# Altium schematic sheet STB_ControlBoard.SchDoc: STB Control Board
size A3; Author: mayerph; DrawnBy: mayerph; Organization: PBL; Revision: B; SheetNumber: 1; SheetTotal: 6
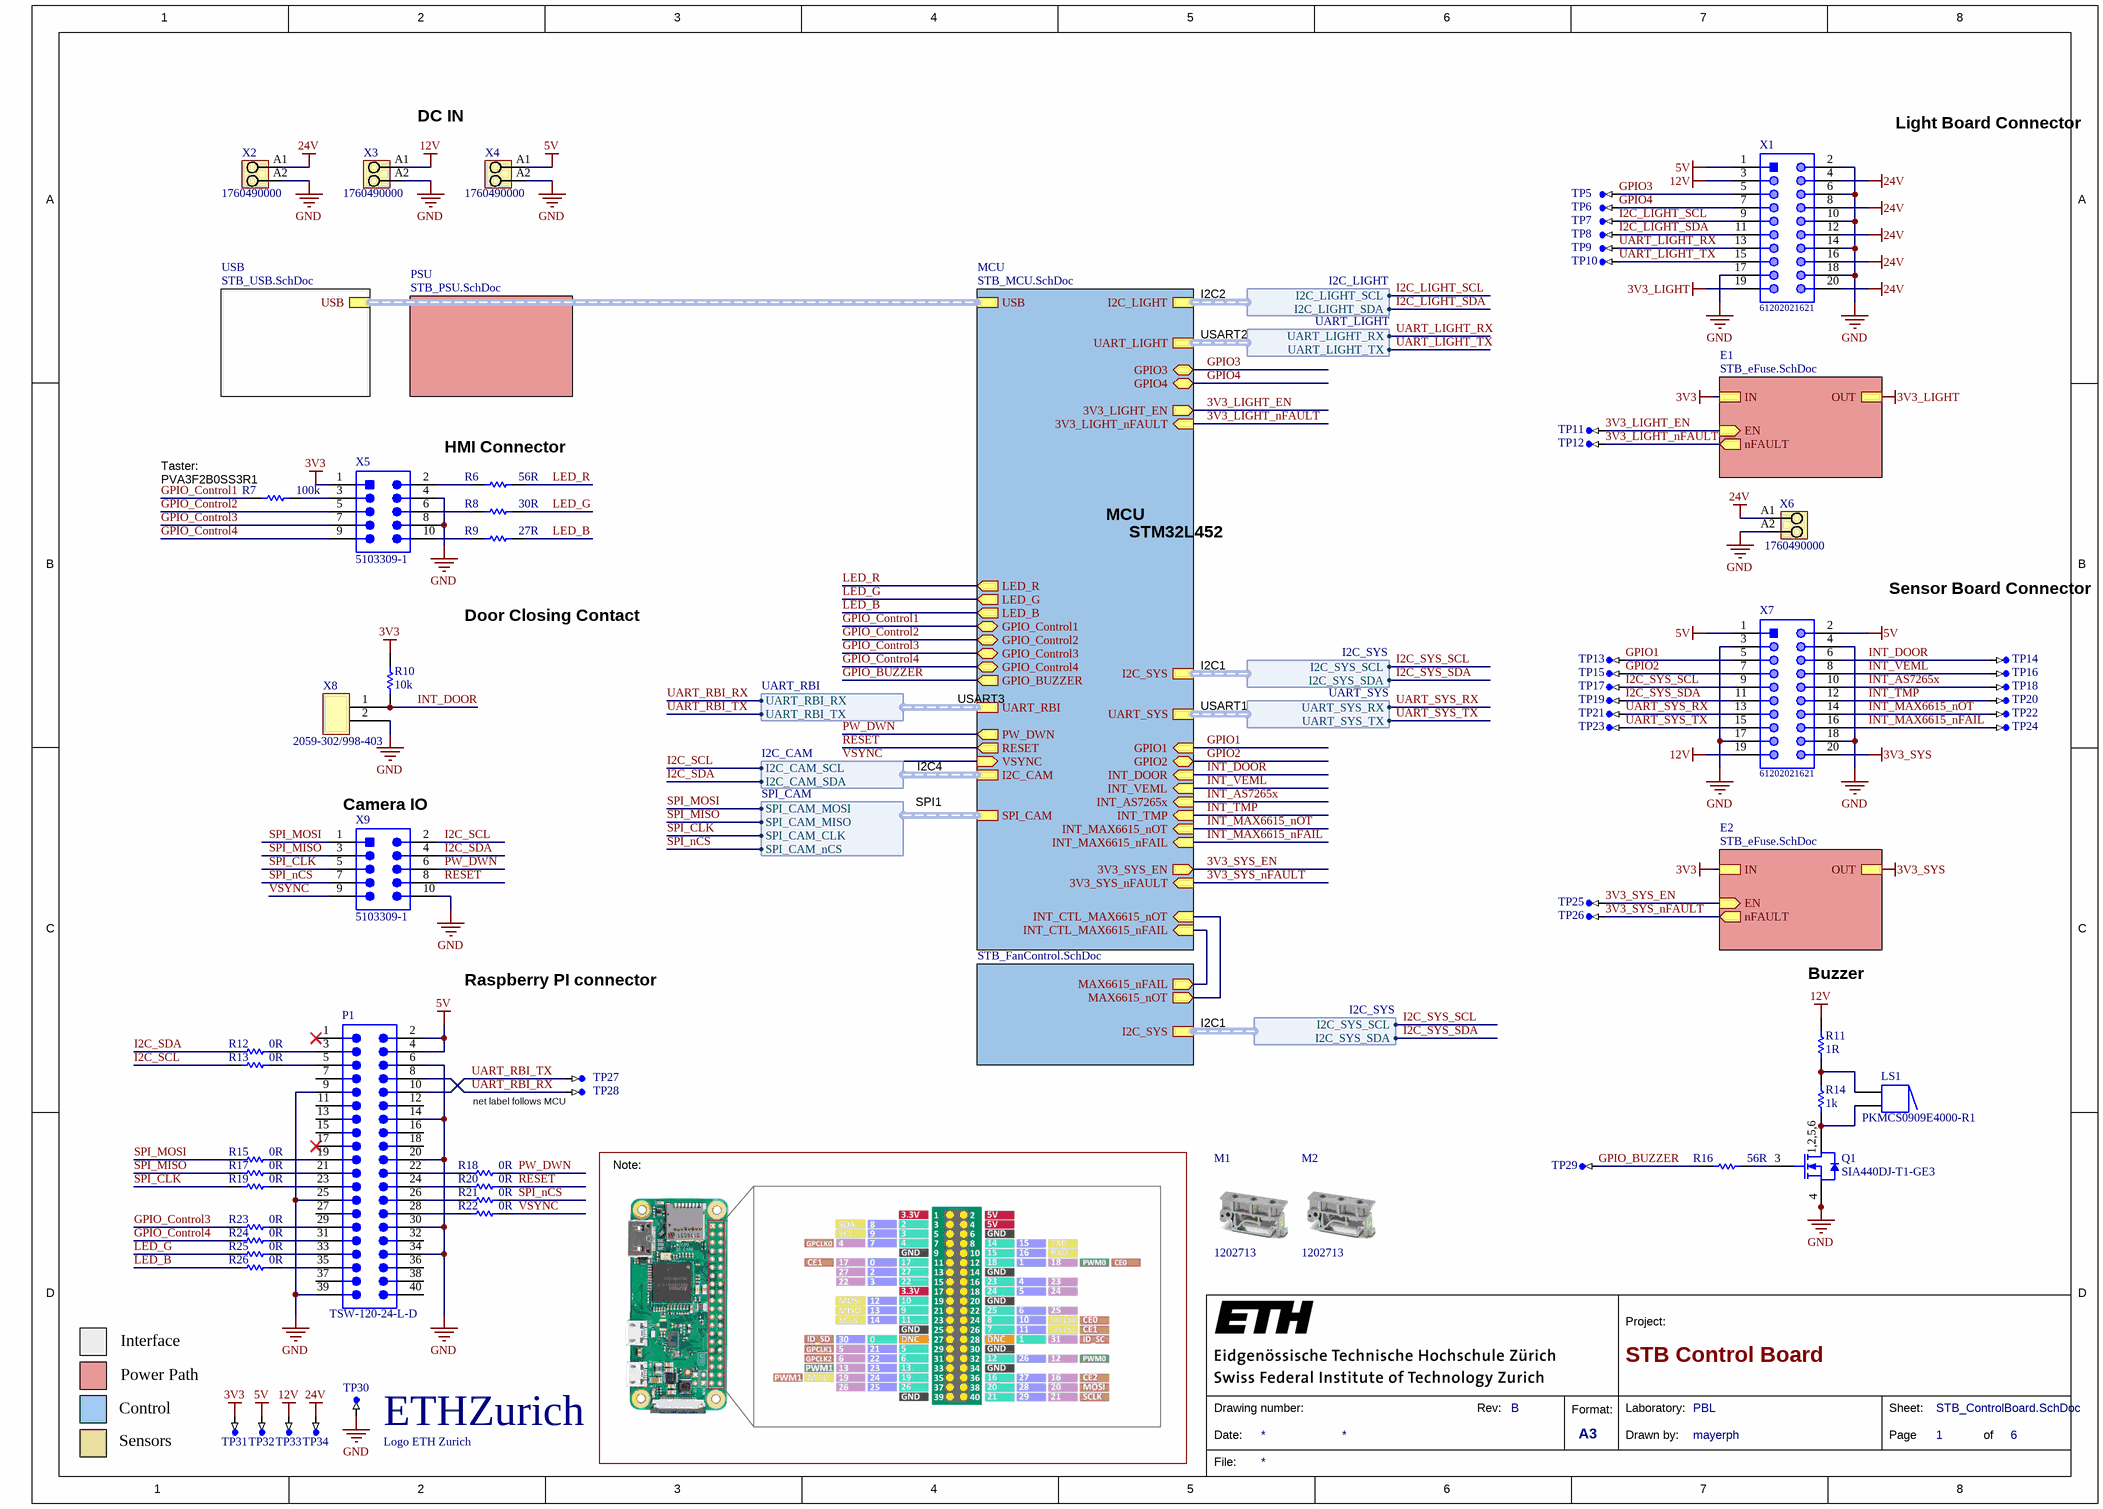
[diagram p0: STB_ControlBoard.SchDoc]

## Parts
A1  Logo ETH Zurich  [eth-zurich_3mm]  (no BOM)
LS1  PKMCS0909E4000-R1  [MURA- PKMCS0909E4000-2_V]
M1  1202713  [1202713]
M2  1202713  [1202713]
P1  TSW-120-24-L-D  [SMTC-TSW-120-24-X-D]
Q1  SIA440DJ-T1-GE3  [SC70-6L_65P210X80_HS-7L]
R6  56R  [RESC1609X50X30LL10T20]
R7  100k  [RESC1005X40X25LL05T10]
R8  30R  [RESC1609X50X30LL10T20]
R9  27R  [RESC1608X55X30LL15T15]
R10  10k  [RESC1005X40X25LL05T05]
R11  1R  [RESC3225X70X50NL20T20]
R12  0R  [RESC1005X40X25LL05T10]
R13  0R  [RESC1005X40X25LL05T10]
R14  1k  [RESC3216X70X50LL05T20]
R15  0R  [RESC1005X40X25LL05T10]
R16  56R  [RESC1609X50X30LL10T20]
R17  0R  [RESC1005X40X25LL05T10]
R18  0R  [RESC1005X40X25LL05T10]
R19  0R  [RESC1005X40X25LL05T10]
R20  0R  [RESC1005X40X25LL05T10]
R21  0R  [RESC1005X40X25LL05T10]
R22  0R  [RESC1005X40X25LL05T10]
R23  0R  [RESC1005X40X25LL05T10]
R24  0R  [RESC1005X40X25LL05T10]
R25  0R  [RESC1005X40X25LL05T10]
R26  0R  [RESC1005X40X25LL05T10]
TP5  TP_1mm  [TP-SM-C-100]  (value not drawn)  (no BOM)
TP6  TP_1mm  [TP-SM-C-100]  (value not drawn)  (no BOM)
TP7  TP_1mm  [TP-SM-C-100]  (value not drawn)  (no BOM)
TP8  TP_1mm  [TP-SM-C-100]  (value not drawn)  (no BOM)
TP9  TP_1mm  [TP-SM-C-100]  (value not drawn)  (no BOM)
TP10  TP_1mm  [TP-SM-C-100]  (value not drawn)  (no BOM)
TP11  TP_1mm  [TP-SM-C-100]  (value not drawn)  (no BOM)
TP12  TP_1mm  [TP-SM-C-100]  (value not drawn)  (no BOM)
TP13  TP_1mm  [TP-SM-C-100]  (value not drawn)  (no BOM)
TP14  TP_1mm  [TP-SM-C-100]  (value not drawn)  (no BOM)
TP15  TP_1mm  [TP-SM-C-100]  (value not drawn)  (no BOM)
TP16  TP_1mm  [TP-SM-C-100]  (value not drawn)  (no BOM)
TP17  TP_1mm  [TP-SM-C-100]  (value not drawn)  (no BOM)
TP18  TP_1mm  [TP-SM-C-100]  (value not drawn)  (no BOM)
TP19  TP_1mm  [TP-SM-C-100]  (value not drawn)  (no BOM)
TP20  TP_1mm  [TP-SM-C-100]  (value not drawn)  (no BOM)
TP21  TP_1mm  [TP-SM-C-100]  (value not drawn)  (no BOM)
TP22  TP_1mm  [TP-SM-C-100]  (value not drawn)  (no BOM)
TP23  TP_1mm  [TP-SM-C-100]  (value not drawn)  (no BOM)
TP24  TP_1mm  [TP-SM-C-100]  (value not drawn)  (no BOM)
TP25  TP_1mm  [TP-SM-C-100]  (value not drawn)  (no BOM)
TP26  TP_1mm  [TP-SM-C-100]  (value not drawn)  (no BOM)
TP27  TP_1mm  [TP-SM-C-100]  (value not drawn)  (no BOM)
TP28  TP_1mm  [TP-SM-C-100]  (value not drawn)  (no BOM)
TP29  TP_1mm  [TP-SM-C-100]  (value not drawn)  (no BOM)
TP30  TP_1mm  [TP-SM-C-100]  (value not drawn)  (no BOM)
TP31  TP_1mm  [TP-SM-C-100]  (value not drawn)  (no BOM)
TP32  TP_1mm  [TP-SM-C-100]  (value not drawn)  (no BOM)
TP33  TP_1mm  [TP-SM-C-100]  (value not drawn)  (no BOM)
TP34  TP_1mm  [TP-SM-C-100]  (value not drawn)  (no BOM)
X1  61202021621  [61202021621]
X2  1760490000  [PM_5_08_90_02]
X3  1760490000  [PM_5_08_90_02]
X4  1760490000  [PM_5_08_90_02]
X5  5103309-1  [TECO-5103309-1_V]
X6  1760490000  [PM_5_08_90_02]
X7  61202021621  [61202021621]
X8  2059-302/998-403  [2059-302/998-403]
X9  5103309-1  [TECO-5103309-1_V]

## Sub-sheets
E1 = STB_eFuse.SchDoc: IN, OUT, EN (in), nFAULT (out)
E2 = STB_eFuse.SchDoc: IN, OUT, EN (in), nFAULT (out)
FC = STB_FanControl.SchDoc: I2C_SYS (harness I2C_SYS), MAX6615_nOT (out), MAX6615_nFAIL (out)
MCU = STB_MCU.SchDoc: USB (harness USB), I2C_SYS (harness I2C_SYS), GPIO1 (in), I2C_LIGHT (harness I2C_LIGHT), UART_RBI (harness UART_RBI), UART_SYS (harness UART_SYS), UART_LIGHT (harness UART_LIGHT), INT_VEML (in), INT_AS7265x (in), INT_TMP (in), INT_MAX6615_nOT (in), INT_MAX6615_nFAIL (in), GPIO2 (bidir), INT_DOOR (in), GPIO3 (bidir), GPIO4 (bidir), 3V3_LIGHT_EN (out), 3V3_LIGHT_nFAULT (in), 3V3_SYS_EN (out), 3V3_SYS_nFAULT (in), LED_R (out), LED_G (out), LED_B (out), GPIO_Control1 (bidir), GPIO_Control2 (bidir), GPIO_Control3 (bidir), GPIO_Control4 (bidir), GPIO_BUZZER (out), PW_DWN (out), RESET (out), VSYNC (in), I2C_CAM (harness I2C_CAM), SPI_CAM (harness SPI_CAM), INT_CTL_MAX6615_nOT (in), INT_CTL_MAX6615_nFAIL (in)
PSU = STB_PSU.SchDoc: no entries
USB = STB_USB.SchDoc: USB (harness USB_HUB)

## Harnesses
I2C_SYS: I2C_SYS_SDA, I2C_SYS_SCL
I2C_LIGHT: I2C_LIGHT_SDA, I2C_LIGHT_SCL
UART_RBI: UART_RBI_TX, UART_RBI_RX
UART_SYS: UART_SYS_TX, UART_SYS_RX
UART_LIGHT: UART_LIGHT_TX, UART_LIGHT_RX
I2C_CAM: I2C_CAM_SDA, I2C_CAM_SCL
SPI_CAM: SPI_CAM_MISO, SPI_CAM_MOSI, SPI_CAM_CLK, SPI_CAM_nCS

## Nets
3V3: R10.2 TP31.TP X5.1 ; sheet E1/IN, sheet E2/IN
3V3_LIGHT: X1.19 ; sheet E1/OUT
3V3_SYS: X7.20 ; sheet E2/OUT
5V: P1.2 P1.4 TP32.TP X1.1 X4.A1 X7.1 X7.2
12V: R11.2 TP33.TP X1.3 X3.A1 X7.19
24V: TP34.TP X1.4 X1.8 X1.12 X1.16 X1.20 X2.A1 X6.A1
GND: P1.6 P1.9 P1.14 P1.20 P1.25 P1.30 P1.34 P1.39 Q1.4(SOURCE) Q1.S(SOURCE) TP30.TP X1.2 X1.6 X1.10 X1.14 X1.17 X1.18 X2.A2 X3.A2 X4.A2 X5.4 X5.8 X6.A2 X7.3 X7.4 X7.17 X7.18 X8.2 X9.10
3V3_LIGHT_EN: TP11.TP ; sheet MCU/3V3_LIGHT_EN, sheet E1/EN
3V3_LIGHT_nFAULT: TP12.TP ; sheet MCU/3V3_LIGHT_nFAULT, sheet E1/nFAULT
3V3_SYS_EN: TP25.TP ; sheet MCU/3V3_SYS_EN, sheet E2/EN
3V3_SYS_nFAULT: TP26.TP ; sheet MCU/3V3_SYS_nFAULT, sheet E2/nFAULT
GPIO1: TP13.TP X7.5 ; sheet MCU/GPIO1
GPIO2: TP15.TP X7.7 ; sheet MCU/GPIO2
GPIO3: TP5.TP X1.5 ; sheet MCU/GPIO3
GPIO4: TP6.TP X1.7 ; sheet MCU/GPIO4
GPIO_BUZZER: R16.2 TP29.TP ; sheet MCU/GPIO_BUZZER
GPIO_Control1: R7.2 ; sheet MCU/GPIO_Control1
GPIO_Control2: X5.5 ; sheet MCU/GPIO_Control2
GPIO_Control3: R23.1 X5.7 ; sheet MCU/GPIO_Control3
GPIO_Control4: R24.1 X5.9 ; sheet MCU/GPIO_Control4
I2C_LIGHT_SCL: TP7.TP X1.9 ; sheet MCU/I2C_LIGHT.I2C_LIGHT_SCL
I2C_LIGHT_SDA: TP8.TP X1.11 ; sheet MCU/I2C_LIGHT.I2C_LIGHT_SDA
I2C_SCL: R13.1 X9.2 ; sheet MCU/I2C_CAM.I2C_CAM_SCL
I2C_SDA: R12.1 X9.4 ; sheet MCU/I2C_CAM.I2C_CAM_SDA
I2C_SYS_SCL: TP17.TP X7.9 ; sheet MCU/I2C_SYS.I2C_SYS_SCL, sheet FC/I2C_SYS.I2C_SYS_SCL
I2C_SYS_SDA: TP19.TP X7.11 ; sheet MCU/I2C_SYS.I2C_SYS_SDA, sheet FC/I2C_SYS.I2C_SYS_SDA
INT_AS7265x: TP18.TP X7.10 ; sheet MCU/INT_AS7265x
INT_DOOR: R10.1 TP14.TP X7.6 X8.1 ; sheet MCU/INT_DOOR
INT_MAX6615_nFAIL: TP24.TP X7.16 ; sheet MCU/INT_MAX6615_nFAIL
INT_MAX6615_nOT: TP22.TP X7.14 ; sheet MCU/INT_MAX6615_nOT
INT_TMP: TP20.TP X7.12 ; sheet MCU/INT_TMP
INT_VEML: TP16.TP X7.8 ; sheet MCU/INT_VEML
LED_B: R9.1 R26.1 ; sheet MCU/LED_B
LED_G: R8.1 R25.1 ; sheet MCU/LED_G
LED_R: R6.1 ; sheet MCU/LED_R
PW_DWN: R18.2 X9.6 ; sheet MCU/PW_DWN
RESET: R20.2 X9.8 ; sheet MCU/RESET
SPI_CLK: R19.1 X9.5 ; sheet MCU/SPI_CAM.SPI_CAM_CLK
SPI_MISO: R17.1 X9.3 ; sheet MCU/SPI_CAM.SPI_CAM_MISO
SPI_MOSI: R15.1 X9.1 ; sheet MCU/SPI_CAM.SPI_CAM_MOSI
SPI_nCS: R21.2 X9.7 ; sheet MCU/SPI_CAM.SPI_CAM_nCS
UART_LIGHT_RX: TP9.TP X1.13 ; sheet MCU/UART_LIGHT.UART_LIGHT_RX
UART_LIGHT_TX: TP10.TP X1.15 ; sheet MCU/UART_LIGHT.UART_LIGHT_TX
UART_RBI_RX: P1.8 TP28.TP ; sheet MCU/UART_RBI.UART_RBI_RX
UART_RBI_TX: P1.10 TP27.TP ; sheet MCU/UART_RBI.UART_RBI_TX
UART_SYS_RX: TP21.TP X7.13 ; sheet MCU/UART_SYS.UART_SYS_RX
UART_SYS_TX: TP23.TP X7.15 ; sheet MCU/UART_SYS.UART_SYS_TX
VSYNC: R22.2 X9.9 ; sheet MCU/VSYNC
NetLS1_1: LS1.1 R11.1 R14.2
NetLS1_2: LS1.2 Q1.1(DRAIN) Q1.2(DRAIN) Q1.5(DRAIN) Q1.6(DRAIN) Q1.TP(DRAIN) R14.1
NetP1_3: P1.3 R12.2
NetP1_5: P1.5 R13.2
NetP1_19: P1.19 R15.2
NetP1_21: P1.21 R17.2
NetP1_22: P1.22 R18.1
NetP1_23: P1.23 R19.2
NetP1_24: P1.24 R20.1
NetP1_26: P1.26 R21.1
NetP1_28: P1.28 R22.1
NetP1_29: P1.29 R23.2
NetP1_31: P1.31 R24.2
NetP1_33: P1.33 R25.2
NetP1_35: P1.35 R26.2
NetQ1_3: Q1.3(GATE) R16.1
NetR6_2: R6.2 X5.2
NetR7_1: R7.1 X5.3
NetR8_2: R8.2 X5.6
NetR9_2: R9.2 X5.10
(unnamed): sheet MCU/INT_CTL_MAX6615_nOT, sheet FC/MAX6615_nOT
(unnamed): sheet MCU/INT_CTL_MAX6615_nFAIL, sheet FC/MAX6615_nFAIL

Not connected (* = marked no-connect by the designer): P1 1* 7 11 12 13 15 16 17* 18 27 32 36 37 38 40

## Buses and harness runs
harness sheet MCU/USB = sheet USB/USB

## Notes on the sheet
- (near X3) DC IN
- (near X1) Light Board Connector
- I2C2
- USART2
- (near X5) HMI Connector
- (near R7) Taster:
  PVA3F2B0SS3R1
- MCU
- STM32L452
- (near R10) Door Closing Contact
- Sensor Board Connector
- USART3
- USART1
- I2C1
- I2C4
- (near X9) Camera IO
- SPI1
- Raspberry PI connector
- (near R11) Buzzer
- (near TP28) net label follows MCU
- Note:
- Interface
- Power Path
- Control
- Sensors
- 1
- 2
- 3
- 4
- 5
- 6
- 7
- 8
- A
- B
- C
- D
- Project:
- Date:
- Drawing number:
- Rev:
- Format:
- A3
- Drawn by:
- Laboratory:
- Page
- Sheet:
- of
- File:
- (in symbol CMP-00038-1) ETHZurich
- (in symbol SIA440DJ-T1-GE3) 1,2,5,6

## Library data of the parts
A1 = CMP-00038-1
LS1 = CMP-2000-05252-1: Audio Indicators & Alerts Piezo Buzzer, 12.5 V, -40 to 85 degC, 2-Pin SMD, RoHS, Tape and Reel; Manufacturer: Murata; Sound Pressure Level: 65dBA; Voltage Rating: 12.5VDC; Tone: Beep; Brand: MurataElectronics; Frequency: 4kHz; Manufacturer URL: http://www.murata.com/; Height: 1.9mm; Datasheet URL: https://datasheet.ciiva.com/24244/pkmcs0909e4000-r1-304946-24244386.pdf; Series: PK; RoHS: True; Length - mm: 9mm; Product: Speakers; Datasheet Version: Feb-13; Tradename: PIEZORINGER; Product Category: AudioIndicators&Alerts; Factory Pack Quantity: 2000; Dimensions: 9mmLx9mmWx1.9mmH; Height - in: 0.075in; Length - in: 0.354in; Mounting: SMD/SMT; Width - in: 0.354in; Height - mm: 1.9mm; Packaging: Reel; Termination Style: GullwingLead; Width - mm: 9mm; Width: 9mm; Type: Piezoelectric; Length: 9mm; Application: AlertBeep; Manufacturer Part Number: PKMCS0909E4000-R1
M1 M2 = 1202713: EMI/EMD/EMC Protections; Manufacturer: Phoenix Contact; Supplier 1: Digi-Key; Manufacturer Part Number: 1202713; RoHS: Yes; Category: Connectors; Stock 1: 1956; Pricing 1: 1=1.92000, 10=1.47000, 50=1.35240, 100=1.24950, 250=1.19072, 500=1.11720, 1000=1.05876, 2500=1.03951, 5000=1.02411 (USD); ComponentLink1URL: https://datasheet.ciiva.com:443/pdfs/VipMasterIC/IC/PCON/PCON-S-A0000016077/PCON-S-A0000017096-1.pdf?src-supplier=IHS+Markit; ComponentLink1Description: https://datasheet.ciiva.com:443/pdfs/VipMasterIC/IC/PCON/PCON-S-A0000016077/PCON-S-A0000017096-1.pdf?src-supplier=IHS+Markit; ComponentLink2URL: https://datasheet.ciiva.com/6712/1202713-6712528.pdf?src-supplier=Digi-Key; ComponentLink2Description: https://datasheet.ciiva.com/6712/1202713-6712528.pdf?src-supplier=Digi-Key; ComponentLink3URL: https://datasheet.ciiva.com/15656/1202713-15656099.pdf?src-supplier=Onlinecomponents.com; ComponentLink3Description: https://datasheet.ciiva.com/15656/1202713-15656099.pdf?src-supplier=Onlinecomponents.com; ComponentLink4URL: https://datasheet.ciiva.com/29271/715928-da-01-de-schienenadapter-1202713-10-st-29271415.pdf?src-supplier=Conrad; ComponentLink4Description: https://datasheet.ciiva.com/29271/715928-da-01-de-schienenadapter-1202713-10-st-29271415.pdf?src-supplier=Conrad; ComponentLink5URL: https://datasheet.ciiva.com/14616/70171402-14616683.pdf?src-supplier=Allied+Electronics; ComponentLink5Description: https://datasheet.ciiva.com/14616/70171402-14616683.pdf?src-supplier=Allied+Electronics; Supplier Part Number 1: 277-2289-ND
P1 = CMP-1024-00454-1: 0.025" SQ Post Header, Through-hole, Vertical, -55 to 125 degC, 2.54 mm Pitch, 40-Pin, Male, RoHS; Manufacturer: Samtec; Pitch: 2.54 mm; ComponentLink1Description: Manufacturer URL; ComponentLink3URL: http://www.samtec.com/documents/webfiles/cpdf/TSW-XXX-XX-XXX-X-XX-XXX-MKT.pdf; PackageVersion: DM, 8/1988; Orientation: Vertical; Mounting Technology: Through-hole; PackageDescription: .025[0.64] SQ. Post Terminal Strip Assembly; Temperature Range: -55 to 125 degC; ComponentLink1URL: http://www.samtec.com; Manufacturer Part Number: TSW-120-24-L-D; DatasheetVersion: F-214; ComponentLink2URL: http://www.samtec.com/documents/webfiles/pdf/TSW_TH.PDF; ComponentLink3Description: Package Specification; RoHS: True; PackageReference: TSW-120-24-X-D; ComponentLink2Description: Datasheet
Q1 = SIA440DJ-T1-GE3: VISHAY   SIA440DJ-T1-GE3   MOSFET Transistor, N Channel, 12 A, 40 V, 0.021 ohm, 10 V; Manufacturer: Vishay Siliconix; Element Configuration: Single; Rds On Max: 26mR; Number of Channels: 1; Drain to Source Voltage (Vdss): 40V; Continuous Drain Current (ID): 12A; Max Power Dissipation: 19W; Gate to Source Voltage (Vgs): 12V; Input Capacitance: 700pF; Rise Time: 32ns; Turn-On Delay Time: 12ns; Fall Time: 5ns; Turn-Off Delay Time: 23ns; Supplier 1: Digi-Key; Manufacturer Part Number: SIA440DJ-T1-GE3; RoHS: Yes; Category: MOSFETs; Stock 1: 7570; Pricing 1: 1=0.46000, 10=0.39000, 25=0.36400, 100=0.27040, 250=0.25688, 500=0.21112, 1000=0.17160 (USD); Mount: Surface Mount; Number of Pins: 6; Min Operating Temperature: -55°C; Max Operating Temperature: 150°C; Packaging: Tape and Reel; Package Quantity: 3000; Drain to Source Resistance: 26mR; Drain to Source Breakdown Voltage: 40V; Length: 2.05mm; Height: 0.75mm; Width: 2.05mm; Radiation Hardening: No; REACH SVHC: Unknown; ComponentLink1URL: https://datasheet.ciiva.com/29746/sia440dj-29746688.pdf?src-supplier=Digi-Key; ComponentLink1Description: https://datasheet.ciiva.com/29746/sia440dj-29746688.pdf?src-supplier=Digi-Key; ComponentLink2URL: https://datasheet.ciiva.com/24094/sia440dj-267638-24094753.pdf?src-supplier=Mouser; ComponentLink2Description: https://datasheet.ciiva.com/24094/sia440dj-267638-24094753.pdf?src-supplier=Mouser; Supplier Part Number 1: SIA440DJ-T1-GE3CT-ND
R6 R16 = CMP-2000-03471-1: Manufacturer: Vishay Dale; Part Number: CRCW060356R0FKEA; Tolerance: 1%; Rated Power Dissipation (P): 100mW; Value: 56 Ohm; Temperature Coefficient: 100ppm/°C; Working Voltage: 75V; Rated Temperature: 70°C; Package Height: 0.45mm; Package Length: 1.55mm; Package Width: 0.85mm; Reference Standard: AEC-Q200; Supplier 1: Digi-Key; Supplier Part Number 1: 541-56.0HCT-ND; Manufacturer Part Number: CRCW060356R0FKEA; RoHS: Yes; Category: Chip SMD Resistors; Stock 1: 216; Pricing 1: 1=0.10000, 10=0.03700, 100=0.01490, 1000=0.00670, 2500=0.00582 (USD); Mount: Surface Mount; Number of Pins: 2; Size Code: 0603; Package Shape: Rectangular; Terminal Finish: Nickel; Min Operating Temperature: -55°C; Max Operating Temperature: 155°C; Resistor Type: FIXED RESISTOR; Construction: Chip; Package Style: SMTMeter; Packaging: Tape and Reel; Termination: Wraparound; Technology: METAL GLAZE/THICK FILM; JESD-609 Code: e3; REACH SVHC: Yes; RoHS Compliant: Yes; ComponentLink1URL: https://datasheet.ciiva.com:443/pdfs/VipMasterIC/IC/VISH/VISH-S-A0007266705/VISH-S-A0007266705-1.pdf?src-supplier=IHS+Markit; ComponentLink1Description: https://datasheet.ciiva.com:443/pdfs/VipMasterIC/IC/VISH/VISH-S-A0007266705/VISH-S-A0007266705-1.pdf?src-supplier=IHS+Markit; ComponentLink2URL: https://datasheet.ciiva.com/11810/0900766b80d98afc-11810033.pdf?src-supplier=RSComponents; ComponentLink2Description: https://datasheet.ciiva.com/11810/0900766b80d98afc-11810033.pdf?src-supplier=RSComponents; ComponentLink3URL: https://datasheet.ciiva.com/2465/dcrcwe3-2465643.pdf?src-supplier=Digi-Key; ComponentLink3Description: https://datasheet.ciiva.com/2465/dcrcwe3-2465643.pdf?src-supplier=Digi-Key; ComponentLink4URL: https://datasheet.ciiva.com/3257/dcrcwe3-3257739.pdf?src-supplier=Avnet; ComponentLink4Description: https://datasheet.ciiva.com/3257/dcrcwe3-3257739.pdf?src-supplier=Avnet; ComponentLink5URL: https://datasheet.ciiva.com/22704/1697337-22704443.pdf?src-supplier=Element14; ComponentLink5Description: https://datasheet.ciiva.com/22704/1697337-22704443.pdf?src-supplier=Element14; ComponentLink6URL: https://datasheet.ciiva.com/3257/dcrcwe3-3257740.pdf?src-supplier=Avnet; ComponentLink6Description: https://datasheet.ciiva.com/3257/dcrcwe3-3257740.pdf?src-supplier=Avnet; ComponentLink7URL: https://datasheet.ciiva.com/16785/70201119-16785354.pdf?src-supplier=Allied+Electronics; ComponentLink7Description: https://datasheet.ciiva.com/16785/70201119-16785354.pdf?src-supplier=Allied+Electronics; ComponentLink8URL: https://datasheet.ciiva.com/2465/dcrcwe3-2465644.pdf?src-supplier=Digi-Key; ComponentLink8Description: https://datasheet.ciiva.com/2465/dcrcwe3-2465644.pdf?src-supplier=Digi-Key; ComponentLink9URL: https://datasheet.ciiva.com/7672/1697337-7672917.pdf?src-supplier=Element14; ComponentLink9Description: https://datasheet.ciiva.com/7672/1697337-7672917.pdf?src-supplier=Element14; ComponentLink10URL: https://datasheet.ciiva.com/2465/dcrcwe3-2465642.pdf?src-supplier=Digi-Key; ComponentLink10Description: https://datasheet.ciiva.com/2465/dcrcwe3-2465642.pdf?src-supplier=Digi-Key; ComponentLink11URL: https://datasheet.ciiva.com/16507/dcrcw-16507994.pdf?src-supplier=Future+Electronics; ComponentLink11Description: https://datasheet.ciiva.com/16507/dcrcw-16507994.pdf?src-supplier=Future+Electronics
R7 = CMP-2002-07343-1: Part Number: RC0402FR-07100KL; Manufacturer: Yageo / Phycomp; Tolerance: 1%; Rated Power Dissipation (P): 62.5mW; Rated Temperature: 70°C; Value: 100 kOhm; Temperature Coefficient: 100ppm/°C; Working Voltage: 50V; Additional Feature: LASER TRIMMABLE; Package Height: 0.35mm; Package Length: 1mm; Package Width: 0.5mm; Supplier 1: Digi-Key; Supplier Part Number 1: 311-100KLRDKR-ND; Manufacturer Part Number: RC0402FR-07100KL; RoHS: Yes; Category: Chip SMD Resistors; Stock 1: 43269933; Pricing 1: 1=0.10000, 10=0.01500, 100=0.00600, 1000=0.00267, 2500=0.00232, 5000=0.00192 (USD); Mount: Surface Mount; Number of Pins: 2; Size Code: 0402; Terminal Finish: Nickel; Package Shape: Rectangular; Min Operating Temperature: -55°C; Max Operating Temperature: 155°C; Resistor Type: FIXED RESISTOR; Technology: METAL GLAZE/THICK FILM; Termination: Wraparound; JESD-609 Code: e3; Construction: Chip; Package Style: SMTMeter; Packaging: Tape and Reel; REACH SVHC: Yes; RoHS Compliant: Yes; ComponentLink1URL: https://datasheet.ciiva.com:443/pdfs/VipMasterIC/IC/YAGO/YAGO-S-A0008145938/YAGO-S-A0008145938-1.pdf?src-supplier=IHS+Markit; ComponentLink1Description: https://datasheet.ciiva.com:443/pdfs/VipMasterIC/IC/YAGO/YAGO-S-A0008145938/YAGO-S-A0008145938-1.pdf?src-supplier=IHS+Markit
R8 = CMP-2000-03228-1: Part Number: CRCW060330R0FKEA; Manufacturer: Vishay Dale; Tolerance: 1%; Rated Power Dissipation (P): 100mW; Value: 30 Ohm; Temperature Coefficient: 100ppm/°C; Working Voltage: 75V; Rated Temperature: 70°C; Package Height: 0.45mm; Package Length: 1.55mm; Package Width: 0.85mm; Reference Standard: AEC-Q200; Supplier 1: Digi-Key; Supplier Part Number 1: 541-30.0HDKR-ND; Manufacturer Part Number: CRCW060330R0FKEA; RoHS: Yes; Category: Chip SMD Resistors; Stock 1: 1285; Pricing 1: 1=0.10000, 10=0.03700, 100=0.01490, 1000=0.00670, 2500=0.00582 (USD); Mount: Surface Mount; Number of Pins: 2; Size Code: 0603; Package Shape: Rectangular; Terminal Finish: Nickel; Min Operating Temperature: -55°C; Max Operating Temperature: 155°C; Construction: Chip; Packaging: Tape and Reel; Resistor Type: FIXED RESISTOR; Package Style: SMTMeter; Termination: Wraparound; Technology: METAL GLAZE/THICK FILM; JESD-609 Code: e3; REACH SVHC: Yes; RoHS Compliant: Yes; ComponentLink1URL: https://datasheet.ciiva.com:443/pdfs/VipMasterIC/IC/VISH/VISH-S-A0007266705/VISH-S-A0007266705-1.pdf?src-supplier=IHS+Markit; ComponentLink1Description: https://datasheet.ciiva.com:443/pdfs/VipMasterIC/IC/VISH/VISH-S-A0007266705/VISH-S-A0007266705-1.pdf?src-supplier=IHS+Markit; ComponentLink2URL: https://datasheet.ciiva.com/11812/0900766b80d98afc-11812614.pdf?src-supplier=RSComponents; ComponentLink2Description: https://datasheet.ciiva.com/11812/0900766b80d98afc-11812614.pdf?src-supplier=RSComponents; ComponentLink3URL: https://datasheet.ciiva.com/2466/dcrcwe3-2466161.pdf?src-supplier=Digi-Key; ComponentLink3Description: https://datasheet.ciiva.com/2466/dcrcwe3-2466161.pdf?src-supplier=Digi-Key; ComponentLink4URL: https://datasheet.ciiva.com/2466/dcrcwe3-2466162.pdf?src-supplier=Digi-Key; ComponentLink4Description: https://datasheet.ciiva.com/2466/dcrcwe3-2466162.pdf?src-supplier=Digi-Key; ComponentLink5URL: https://datasheet.ciiva.com/2466/dcrcwe3-2466163.pdf?src-supplier=Digi-Key; ComponentLink5Description: https://datasheet.ciiva.com/2466/dcrcwe3-2466163.pdf?src-supplier=Digi-Key; ComponentLink6URL: https://datasheet.ciiva.com/7732/1697337-7732041.pdf?src-supplier=Element14; ComponentLink6Description: https://datasheet.ciiva.com/7732/1697337-7732041.pdf?src-supplier=Element14; ComponentLink7URL: https://datasheet.ciiva.com/8338/dcrcwe3-8338278.pdf?src-supplier=Avnet; ComponentLink7Description: https://datasheet.ciiva.com/8338/dcrcwe3-8338278.pdf?src-supplier=Avnet; ComponentLink8URL: https://datasheet.ciiva.com/16767/70201119-16767414.pdf?src-supplier=Allied+Electronics; ComponentLink8Description: https://datasheet.ciiva.com/16767/70201119-16767414.pdf?src-supplier=Allied+Electronics; ComponentLink9URL: https://datasheet.ciiva.com/5546/dcrcwe3-109170-5546968.pdf?src-supplier=Mouser; ComponentLink9Description: https://datasheet.ciiva.com/5546/dcrcwe3-109170-5546968.pdf?src-supplier=Mouser; ComponentLink10URL: https://datasheet.ciiva.com/7732/1697337-7732040.pdf?src-supplier=Element14; ComponentLink10Description: https://datasheet.ciiva.com/7732/1697337-7732040.pdf?src-supplier=Element14; ComponentLink11URL: https://datasheet.ciiva.com/22708/1697337-22708344.pdf?src-supplier=Element14; ComponentLink11Description: https://datasheet.ciiva.com/22708/1697337-22708344.pdf?src-supplier=Element14
R9 = CMP-2000-00757-1: Part Number: ERJ-3GEYJ270V; Manufacturer: Panasonic; Manufacturer Part Number: ERJ-3EKF27R0V; Tolerance: 1%; Rated Power Dissipation (P): 100mW; Value: 27 Ohm; Temperature Coefficient: 100ppm/°C; Working Voltage: 75V; Rated Temperature: 70°C; Package Height: 0.45mm; Package Length: 1.6mm; Package Width: 0.8mm; Reference Standard: AEC-Q200; Supplier 1: RSComponents; Supplier Part Number 1: 1763578; RoHS: Yes; Category: Chip SMD Resistors; Stock 1: 109978; Pricing 1: 1000=0.01300 (CHF); Mount: Surface Mount; Number of Pins: 2; Size Code: 0603; Package Shape: Rectangular; Terminal Finish: Nickel; Min Operating Temperature: -55°C; Max Operating Temperature: 155°C; Resistor Type: FIXED RESISTOR; Construction: Rectangular; Package Style: SMTMeter; Packaging: Tape and Reel; Technology: METAL GLAZE/THICK FILM; Termination: Wraparound; JESD-609 Code: e3; REACH SVHC: Yes; RoHS Compliant: Yes; ComponentLink1URL: https://datasheet.ciiva.com:443/pdfs/VipMasterIC/IC/PANA/PANA-S-A0009889626/PANA-S-A0009889626-1.pdf?src-supplier=IHS+Markit; ComponentLink1Description: https://datasheet.ciiva.com:443/pdfs/VipMasterIC/IC/PANA/PANA-S-A0009889626/PANA-S-A0009889626-1.pdf?src-supplier=IHS+Markit; ComponentLink2URL: https://datasheet.ciiva.com/46381/1678782-46381559.pdf?src-supplier=Element14; ComponentLink2Description: https://datasheet.ciiva.com/46381/1678782-46381559.pdf?src-supplier=Element14; ComponentLink3URL: https://datasheet.ciiva.com/22681/1678782-22681182.pdf?src-supplier=Element14; ComponentLink3Description: https://datasheet.ciiva.com/22681/1678782-22681182.pdf?src-supplier=Element14; ComponentLink4URL: https://datasheet.ciiva.com/28568/1678782-28568703.pdf?src-supplier=Element14; ComponentLink4Description: https://datasheet.ciiva.com/28568/1678782-28568703.pdf?src-supplier=Element14; ComponentLink5URL: https://datasheet.ciiva.com/46381/1678782-46381558.pdf?src-supplier=Element14; ComponentLink5Description: https://datasheet.ciiva.com/46381/1678782-46381558.pdf?src-supplier=Element14; ComponentLink6URL: https://datasheet.ciiva.com/24069/aoa0000ce2-24069132.pdf?src-supplier=Mouser; ComponentLink6Description: https://datasheet.ciiva.com/24069/aoa0000ce2-24069132.pdf?src-supplier=Mouser; ComponentLink7URL: https://datasheet.ciiva.com/16776/70260748-16776005.pdf?src-supplier=Allied+Electronics; ComponentLink7Description: https://datasheet.ciiva.com/16776/70260748-16776005.pdf?src-supplier=Allied+Electronics; ComponentLink8URL: https://datasheet.ciiva.com/16779/70260748-16779605.pdf?src-supplier=Allied+Electronics; ComponentLink8Description: https://datasheet.ciiva.com/16779/70260748-16779605.pdf?src-supplier=Allied+Electronics; ComponentLink9URL: https://datasheet.ciiva.com/9116/aoa0000ce2-9116957.pdf?src-supplier=Avnet; ComponentLink9Description: https://datasheet.ciiva.com/9116/aoa0000ce2-9116957.pdf?src-supplier=Avnet; ComponentLink10URL: https://datasheet.ciiva.com/9191/aoa0000ce2-9191131.pdf?src-supplier=Avnet; ComponentLink10Description: https://datasheet.ciiva.com/9191/aoa0000ce2-9191131.pdf?src-supplier=Avnet; ComponentLink11URL: https://datasheet.ciiva.com/30124/aoa0000ce2-30124664.pdf?src-supplier=Onlinecomponents.com; ComponentLink11Description: https://datasheet.ciiva.com/30124/aoa0000ce2-30124664.pdf?src-supplier=Onlinecomponents.com
R10 = CMP-2000-07588-1: Chip Resistor, 10 KOhm, +/- 1%, 0.1 W, -55 to 155 degC, 0402 (1005 Metric), RoHS, Tape and Reel; Manufacturer: Panasonic; Manufacturer Part Number: ERJ-2RKF1002X; Power Rating: 100mW; Voltage Rating: 50V; Value: 10 kOhm; Case\/Package: 0402; Temperature Coefficient: 100ppm\/degreesC; Rated Temperature: 70°C; Package Height: 0.35mm; Package Length: 1mm; Package Width: 0.5mm; Reference Standard: AEC-Q200; RoHSCompliant: True; Lead Free: LeadFree; Package Quantity: 1; Contact Plating: Tin; Length: 1mm; Radiation Hardening: No; REACH SVHC: NoSVHC; Max Operating Temperature: 155degC; Depth: 0.5mm; Case Code (Imperial): 0402; Military Standard: Not; Package Description: 2-Pin Surface Mount Device, Body 1 x 0.5 mm; Termination: SMD/SMT; Case Code (Metric): 1005; Height: 0.35mm; Packaging: TapeandReel; Voltage Rating (DC): 50V; Package Reference: 402; Number of Pins: 2; Tolerance: 1%; Mounting Technology: SurfaceMount; Width: 0.02inch; Mount: SurfaceMount; Datasheet URL: https://industrial.panasonic.com/cdbs/www-data/pdf/RDA0000/AOA0000C304.pdf; Composition: ThickFilm; Datasheet Version: 02/2017; Manufacturer URL: http://www.panasonic.com/; Max Power Dissipation: 100mW; Number of Terminations: 2; Min Operating Temperature: -55degC; Supplier 1: Digi-Key; Supplier Part Number 1: P10.0KLDKR-ND; RoHS: Yes; Category: Chip SMD Resistors; Stock 1: 108; Pricing 1: 1=0.10000, 10=0.03300, 100=0.01330, 1000=0.00599, 2500=0.00520, 5000=0.00429 (USD); Size Code: 0402; Terminal Finish: Nickel; Package Shape: Rectangular; Resistor Type: FIXED RESISTOR; Rated Power Dissipation (P): 100mW; Technology: METAL GLAZE/THICK FILM; Working Voltage: 50V; Construction: Rectangular; Package Style: SMTMeter; JESD-609 Code: e3; RoHS Compliant: Yes; ComponentLink1URL: https://datasheet.ciiva.com:443/pdfs/VipMasterIC/IC/PANA/PANA-S-A0009889626/PANA-S-A0009889626-1.pdf?src-supplier=IHS+Markit; ComponentLink1Description: https://datasheet.ciiva.com:443/pdfs/VipMasterIC/IC/PANA/PANA-S-A0009889626/PANA-S-A0009889626-1.pdf?src-supplier=IHS+Markit; ComponentLink2URL: https://datasheet.ciiva.com/11821/0900766b80f80784-11821171.pdf?src-supplier=RSComponents; ComponentLink2Description: https://datasheet.ciiva.com/11821/0900766b80f80784-11821171.pdf?src-supplier=RSComponents; ComponentLink3URL: https://datasheet.ciiva.com/27055/1987020-27055643.pdf?src-supplier=Jameco; ComponentLink3Description: https://datasheet.ciiva.com/27055/1987020-27055643.pdf?src-supplier=Jameco; ComponentLink4URL: https://datasheet.ciiva.com/43467/1678782-43467402.pdf?src-supplier=Farnell; ComponentLink4Description: https://datasheet.ciiva.com/43467/1678782-43467402.pdf?src-supplier=Farnell; ComponentLink5URL: https://datasheet.ciiva.com/28514/1678782-28514185.pdf?src-supplier=Element14; ComponentLink5Description: https://datasheet.ciiva.com/28514/1678782-28514185.pdf?src-supplier=Element14; ComponentLink6URL: https://datasheet.ciiva.com/24023/aoa0000ce2-24023017.pdf?src-supplier=Mouser; ComponentLink6Description: https://datasheet.ciiva.com/24023/aoa0000ce2-24023017.pdf?src-supplier=Mouser; ComponentLink7URL: https://datasheet.ciiva.com/16782/70260748-16782590.pdf?src-supplier=Allied+Electronics; ComponentLink7Description: https://datasheet.ciiva.com/16782/70260748-16782590.pdf?src-supplier=Allied+Electronics; ComponentLink8URL: https://datasheet.ciiva.com/16786/70260748-16786734.pdf?src-supplier=Allied+Electronics; ComponentLink8Description: https://datasheet.ciiva.com/16786/70260748-16786734.pdf?src-supplier=Allied+Electronics; ComponentLink9URL: https://datasheet.ciiva.com/9194/aoa0000ce2-9194142.pdf?src-supplier=Avnet; ComponentLink9Description: https://datasheet.ciiva.com/9194/aoa0000ce2-9194142.pdf?src-supplier=Avnet; ComponentLink10URL: https://datasheet.ciiva.com/16199/aoa0000ce2-16199478.pdf?src-supplier=Future+Electronics; ComponentLink10Description: https://datasheet.ciiva.com/16199/aoa0000ce2-16199478.pdf?src-supplier=Future+Electronics; ComponentLink11URL: https://datasheet.ciiva.com/48531/aoa0000ce2-48531069.pdf?src-supplier=Avnet; ComponentLink11Description: https://datasheet.ciiva.com/48531/aoa0000ce2-48531069.pdf?src-supplier=Avnet; ComponentLink12URL: https://datasheet.ciiva.com/30201/aoa0000ce2-30201022.pdf?src-supplier=Onlinecomponents.com; ComponentLink12Description: https://datasheet.ciiva.com/30201/aoa0000ce2-30201022.pdf?src-supplier=Onlinecomponents.com
R11 = CMP-2005-03789-1: Part Number: ERJ14BQF1R0U; Manufacturer: Panasonic; Tolerance: 1%; Rated Power Dissipation (P): 500mW; Rated Temperature: 70°C; Value: 1 Ohm; Temperature Coefficient: 100ppm/°C; Reference Standard: AEC-Q200; Supplier 1: Digi-Key; Supplier Part Number 1: P17253CT-ND; Manufacturer Part Number: ERJ14BQF1R0U; RoHS: Yes; Category: Chip SMD Resistors; Stock 1: 77; Pricing 1: 1=0.59000, 10=0.45200, 100=0.19010, 1000=0.10486, 2500=0.09831 (USD); Mount: Surface Mount; Number of Pins: 2; Package Shape: Rectangular; Size Code: 1210; Terminal Finish: Nickel; Min Operating Temperature: -55°C; Max Operating Temperature: 125°C; JESD-609 Code: e3; Resistor Type: FIXED RESISTOR; Packaging: Tape and Reel; Technology: METAL GLAZE/THICK FILM; Termination: Wraparound; RoHS Compliant: Yes; Reach SVHC Compliant: Yes; ComponentLink1URL: https://datasheet.ciiva.com:443/pdfs/VipMasterIC/IC/PANA/PANA-S-A0009615198/PANA-S-A0009615198-1.pdf?src-supplier=IHS+Markit; ComponentLink1Description: https://datasheet.ciiva.com:443/pdfs/VipMasterIC/IC/PANA/PANA-S-A0009615198/PANA-S-A0009615198-1.pdf?src-supplier=IHS+Markit; ComponentLink2URL: https://datasheet.ciiva.com/11810/0900766b80eefa12-11810873.pdf?src-supplier=RSComponents; ComponentLink2Description: https://datasheet.ciiva.com/11810/0900766b80eefa12-11810873.pdf?src-supplier=RSComponents; ComponentLink3URL: https://datasheet.ciiva.com/48533/erj-eng-tds-48533543.pdf?src-supplier=Distrelec; ComponentLink3Description: https://datasheet.ciiva.com/48533/erj-eng-tds-48533543.pdf?src-supplier=Distrelec; ComponentLink4URL: https://datasheet.ciiva.com/48516/erj-eng-tds-48516877.pdf?src-supplier=Distrelec; ComponentLink4Description: https://datasheet.ciiva.com/48516/erj-eng-tds-48516877.pdf?src-supplier=Distrelec; ComponentLink5URL: https://datasheet.ciiva.com/24055/aoa0000ce3-72189-24055482.pdf?src-supplier=Mouser; ComponentLink5Description: https://datasheet.ciiva.com/24055/aoa0000ce3-72189-24055482.pdf?src-supplier=Mouser; ComponentLink6URL: https://datasheet.ciiva.com/9198/aoa0000ce3-9198936.pdf?src-supplier=Avnet; ComponentLink6Description: https://datasheet.ciiva.com/9198/aoa0000ce3-9198936.pdf?src-supplier=Avnet
R12 R13 R15 R17-R26 = CMP-1011-00001-2: Manufacturer: Yageo / Phycomp; Part Number: RC0402JR-070RL; Rated Power Dissipation (P): 62.5mW; Rated Temperature: 70°C; Package Height: 0.35mm; Package Length: 1mm; Package Width: 0.5mm; Supplier 1: Digi-Key; Supplier Part Number 1: 311-0.0JRDKR-ND; Manufacturer Part Number: RC0402JR-070RL; RoHS: Yes; Category: Chip SMD Resistors; Stock 1: 41330354; Pricing 1: 1=0.10000, 10=0.01200, 25=0.00840, 50=0.00640, 100=0.00480, 250=0.00364, 500=0.00290, 1000=0.00214, 5000=0.00154 (USD); Mount: Surface Mount; Number of Pins: 2; Size Code: 0402; Package Shape: Rectangular; Terminal Finish: Nickel; Min Operating Temperature: -55°C; Max Operating Temperature: 155°C; Resistor Type: FIXED RESISTOR; Value: 0R; Packaging: Tape and Reel; Technology: METAL GLAZE/THICK FILM; Termination: Wraparound; JESD-609 Code: e3; Construction: Chip; Package Style: SMTMeter; REACH SVHC: Yes; RoHS Compliant: Yes; ComponentLink1URL: https://datasheet.ciiva.com:443/pdfs/VipMasterIC/IC/YAGO/YAGO-S-A0008145938/YAGO-S-A0008145938-1.pdf?src-supplier=IHS+Markit; ComponentLink1Description: https://datasheet.ciiva.com:443/pdfs/VipMasterIC/IC/YAGO/YAGO-S-A0008145938/YAGO-S-A0008145938-1.pdf?src-supplier=IHS+Markit; ComponentLink2URL: https://datasheet.ciiva.com/2452/pyu-rc0402-51-rohs-l-6-2452608.pdf?src-supplier=Digi-Key; ComponentLink2Description: https://datasheet.ciiva.com/2452/pyu-rc0402-51-rohs-l-6-2452608.pdf?src-supplier=Digi-Key; ComponentLink3URL: https://datasheet.ciiva.com/11808/0900766b80c66297-11808195.pdf?src-supplier=RSComponents; ComponentLink3Description: https://datasheet.ciiva.com/11808/0900766b80c66297-11808195.pdf?src-supplier=RSComponents; ComponentLink4URL: https://datasheet.ciiva.com/7983/1018594-7983535.pdf?src-supplier=Element14; ComponentLink4Description: https://datasheet.ciiva.com/7983/1018594-7983535.pdf?src-supplier=Element14; ComponentLink5URL: https://datasheet.ciiva.com/22747/1018594-22747515.pdf?src-supplier=Element14; ComponentLink5Description: https://datasheet.ciiva.com/22747/1018594-22747515.pdf?src-supplier=Element14; ComponentLink6URL: https://datasheet.ciiva.com/2452/pyu-r-int-thick-7-2452609.pdf?src-supplier=Digi-Key; ComponentLink6Description: https://datasheet.ciiva.com/2452/pyu-r-int-thick-7-2452609.pdf?src-supplier=Digi-Key; ComponentLink7URL: https://datasheet.ciiva.com/2452/pyu-r-int-thick-7-2452610.pdf?src-supplier=Digi-Key; ComponentLink7Description: https://datasheet.ciiva.com/2452/pyu-r-int-thick-7-2452610.pdf?src-supplier=Digi-Key; ComponentLink8URL: https://datasheet.ciiva.com/8896/pyu-rc0402-51-rohs-l-6-8896201.pdf?src-supplier=Avnet; ComponentLink8Description: https://datasheet.ciiva.com/8896/pyu-rc0402-51-rohs-l-6-8896201.pdf?src-supplier=Avnet; ComponentLink9URL: https://datasheet.ciiva.com/15189/getdatasheetpartid-326379-15189533.pdf?src-supplier=Verical; ComponentLink9Description: https://datasheet.ciiva.com/15189/getdatasheetpartid-326379-15189533.pdf?src-supplier=Verical; Parameter 1: *
R14 = CMP-2003-00017-1: Manufacturer: Panasonic; Part Number: ERJ-8ENF1001V; Tolerance: 1%; Rated Power Dissipation (P): 250mW; Rated Temperature: 70°C; Value: 1 kOhm; Temperature Coefficient: 100ppm/°C; Working Voltage: 200V; Package Height: 0.6mm; Package Length: 3.2mm; Package Width: 1.6mm; Reference Standard: AEC-Q200; Supplier 1: Digi-Key; Supplier Part Number 1: P1.00KFDKR-ND; Manufacturer Part Number: ERJ-8ENF1001V; RoHS: Yes; Category: Chip SMD Resistors; Stock 1: 194943; Pricing 1: 1=0.18000, 10=0.15400, 100=0.06030, 1000=0.02522, 2500=0.02312 (USD); Mount: Surface Mount; Number of Pins: 2; Terminal Finish: Nickel; Size Code: 1206; Package Shape: Rectangular; Min Operating Temperature: -55°C; Max Operating Temperature: 155°C; JESD-609 Code: e3; Packaging: Tape and Reel; Resistor Type: FIXED RESISTOR; Construction: Rectangular; Technology: METAL GLAZE/THICK FILM; Termination: Wraparound; Package Style: SMTMeter; Reach SVHC Compliant: Yes; RoHS Compliant: Yes; ComponentLink1URL: https://datasheet.ciiva.com:443/pdfs/VipMasterIC/IC/PANA/PANA-S-A0009889626/PANA-S-A0009889626-1.pdf?src-supplier=IHS+Markit; ComponentLink1Description: https://datasheet.ciiva.com:443/pdfs/VipMasterIC/IC/PANA/PANA-S-A0009889626/PANA-S-A0009889626-1.pdf?src-supplier=IHS+Markit
TP5-TP34 = testPoint_1mm: testPoint 1mm
X1 X7 = CMP-1502-00010-1: Male Box Header WR-BHD, THT, Vertical, pitch 2.54 mm, 20 pins; Manufacturer: Wurth Elektronik; Contact Resistance: 20mOhm; Withstanding Voltage: 500VAC; Pitch: 2.54mm; Pin Number: 20; Working Voltage: 250VAC; Connector Type: Male Pin; Current Rating: 3A; Voltage Rating: 250V; Insulation Resistance: 1GR; Insulation: Insulated; Row Spacing: 0.1inch; Orientation: Vertical; Package Reference: 61202021621; Publisher: WurthElektronik; Datasheet URL: https://katalog.we-online.de/em/datasheet/6120xx21621.pdf; Operating Temperature: -40to125degC; Packaging: Tray; Part Number: 61202021621; Mounting Technology: THT; Gender: Male; Manufacturer URL: http://www.we-online.de; Published Date: August2018; Supplier 1: Digi-Key; Supplier Part Number 1: 732-2096-ND; Manufacturer Part Number: 61202021621; RoHS: Yes; Category: Headers and Wire Housings; Stock 1: 19791; Pricing 1: 1=0,95000, 10=0,93200, 50=0,85900, 160=0,76900, 320=0,68000 (USD); Mount: Through Hole; Contact Plating: Gold; Contact Material: Copper Alloy,Copper; Color: Black; Housing Material: PBT; Min Operating Temperature: -40°C; Max Operating Temperature: 125°C; Number of Rows: 2; Number of Positions: 20; Termination: Through Hole; Number of Contacts: 20; Series: WR-BHD; Package Quantity: 160; Contact Type: Male Pin; Contact Gender: Male; Length: 33.06mm; Width: 33.06mm; Height: 8.85mm; REACH SVHC: Unknown; RoHS Compliant: Yes; Flammability Rating: UL94 V-0; ComponentLink1URL: https://datasheet.ciiva.com/731/6120xx21621-731346.pdf?src-supplier=Digi-Key; ComponentLink1Description: https://datasheet.ciiva.com/731/6120xx21621-731346.pdf?src-supplier=Digi-Key
X2-X4 X6 = CMP-1559-01627-1: OMNIMATE Signal - series PM; Manufacturer: Weidmueller; Contact_surface: tinned; Pitch_mm: 5,08 mm; Solid_min_H05_07_V_U: 0,13 mm²; Wire_cross_section_AWG_min_UL_1059: AWG 26; Wire_cross_section_AWG_max_UL_1059: AWG 14; Rated_voltage_for_surge_voltage_class_pollution_degree_II_2: 600 V; Rated_current_use_group_B_UL_1059: 15 A; Mounting_onto_the_PCB: Solder connection; Solder_pin_length_mm: 3,5 mm; Side_termination_characteristic: closed side; Contact_material: Cu-Leg; Pitch_inch: 0,2 inch; No_of_poles: 2; UL_94_flammability_rating: V-0; Insulating_material: Wemid (PA); Rated_voltage_use_group_B_UL_1059: 300 V; Solid_max_H05_07_V_U: 2,5 mm²; Short_text_for_material: PM 5.08/02/90 3.5SN OR BX; Fastening Method: SOLDER; Number of Decks: 1; Current Rating: 24A; Voltage Rating: 600V; Additional Feature: STANDARD: UL 94V-0; Wire Cross Section: 2.5mm2; Wire/Cable Gauge: 14AWG; Safety Approval: UL,CSA; Revision: V1; PartNumber: 1760490000; Qty: 500 PCS; ComponentLink2Description: URL Link1; Packaging: Box; PackageReference: PM_5_08_90_02; ComponentLink2URL: http://catalog.weidmueller.com/catalog/Start.do?localeId=en&ObjectID=1760490000; Colour: Orange; ComponentLink1Description: Manufacturer URL; ComponentLink1URL: http://www.weidmueller.com/; Supplier 1: Digi-Key; Supplier Part Number 1: 281-2888-ND; Manufacturer Part Number: 1760490000; RoHS: Yes; Category: Terminal Blocks; Stock 1: 17520; Pricing 1: 1=0.72000, 10=0.45000, 25=0.38480, 50=0.34600, 100=0.33870, 250=0.28828, 500=0.27386, 1000=0.24503, 5000=0.20820 (USD); Mount: Board; Terminal and Terminal Block Type: MODULAR TERMINAL BLOCK; Manufacturer Series: 1760490000; Number of Rows: 1; Number of Ways: 2; REACH SVHC: Yes; RoHS Compliant: Yes; ComponentLink3URL: https://datasheet.ciiva.com:443/pdfs/VipMasterIC/IC/WEID/WEIDS07855/WEIDS07855-1.pdf?src-supplier=IHS+Markit; ComponentLink3Description: https://datasheet.ciiva.com:443/pdfs/VipMasterIC/IC/WEID/WEIDS07855/WEIDS07855-1.pdf?src-supplier=IHS+Markit; ComponentLink4URL: https://datasheet.ciiva.com/16046/1760490000-pm-5-08-02-90-3-5sn-or-bx-en-pdf-148-16046417.pdf?src-supplier=Onlinecomponents.com; ComponentLink4Description: https://datasheet.ciiva.com/16046/1760490000-pm-5-08-02-90-3-5sn-or-bx-en-pdf-148-16046417.pdf?src-supplier=Onlinecomponents.com; ComponentLink5URL: https://datasheet.ciiva.com/823/1760490000-823936.pdf?src-supplier=Digi-Key; ComponentLink5Description: https://datasheet.ciiva.com/823/1760490000-823936.pdf?src-supplier=Digi-Key
X5 X9 = CMP-2000-07502-1: Male Header, Pitch 2.54 mm, 2 x 5 Position, Height 9.855 mm, Tail Length 3.048 mm, -65 to 105 degC, RoHS, Tube; Manufacturer: TE Connectivity; PCB Mounting Orientation: Vertical; Pitch: 2.54mm; Mating Connector Lock: No(Without); Body Material: Thermoplastic; Shrouded: Yes(With); Connector System: Wire-to-Board; Insulation Resistance: 5GR; Number of Positions: 10; Max Current Rating: 1A; PCB Mount Retention: Without; Manufacturer URL: http://www.te.com/; Contact Plating: Gold; Datasheet URL: http://www.te.com/commerce/DocumentDelivery/DDEController?Action=showdoc&DocId=Customer+Drawing%7F5103309%7FE1%7Fpdf%7FEnglish%7FENG_CD_5103309_E1.pdf%7F5103309-1; Colour: Black; Termination: ThroughHole; Housing Colour: Black; Flammability Rating: UL94V-0; Package Description: Male Header, Pitch 2.54 mm, 2 x 5 Position, Height 9.855 mm, Tail Length 3.048 mm; Mating Retention: No(Without); Orientation: Straight; Row Spacing: 2.54mm; Termination Post Length: 0.12inch; Min Operating Temperature: -65degC; Board Standoff: Yes(With); REACH SVHC: NoSVHC; Depth: 9.14mm; Lead Free: LeadFree; Gender: Male; Connector Type: Header; Shrouded End Dimension: 3.81mm; ELV: Compliant; Mating Alignment: Yes(With); Panel Mount Retention: No(Without); Package Quantity: 35; PCB Mount Alignment: No(Without); Number of Rows: 2; Manufacturer Part Number: 5103309-1; Mounting Technology: ThroughHole; Mount: ThroughHole; Contact Gender: Male; Number of Contacts: 10; Length: 0.8inch; Current Rating: 1A; Contact Mating Length: 0.24inch; Max Operating Temperature: 105degC; RoHSCompliant: True; Datasheet Version: Rev. E1, 03/2011; Contact Shape: Square; Height: 8.813mm; Housing Material: PBT; Contact Material: CopperAlloy; Packaging: Rail/Tube
X8 = 2059-302/998-403: Barrier Strip Terminal Block, 3A, 0.34mm2, 1 Row(s), 1 Deck(s); Manufacturer: WAGO; Fastening Method: PUSH-IN; Number of Decks: 1; Number of Ways: 2; Voltage Rating: 250V; Wire/Cable Gauge: 22AWG; Safety Approval: UL; Supplier 1: Digi-Key; Manufacturer Part Number: 2059-302/998-403; RoHS: Yes; Category: Connectors; Stock 1: 17368; Pricing 1: 1=1.25000, 10=0.87800, 25=0.81880, 50=0.74320, 100=0.73990, 250=0.62484, 500=0.59194 (USD); Mount: Board; Number of Rows: 1; Current Rating: 3A; Terminal and Terminal Block Type: BARRIER STRIP TERMINAL BLOCK; Wire Cross Section: 0.34mm2; REACH SVHC: Yes; RoHS Compliant: Yes; ComponentLink1URL: https://datasheet.ciiva.com:443/pdfs/VipMasterIC/IC/WAGO/WAGO-S-A0007107760/WAGO-S-A0007107948-1.pdf?src-supplier=IHS+Markit; ComponentLink1Description: https://datasheet.ciiva.com:443/pdfs/VipMasterIC/IC/WAGO/WAGO-S-A0007107760/WAGO-S-A0007107948-1.pdf?src-supplier=IHS+Markit; ComponentLink2URL: https://datasheet.ciiva.com/41441/001208172-da-01-de-smd-leiterplattenklemme-2059-302-998-404-41441808.pdf?src-supplier=Conrad; ComponentLink2Description: https://datasheet.ciiva.com/41441/001208172-da-01-de-smd-leiterplattenklemme-2059-302-998-404-41441808.pdf?src-supplier=Conrad; ComponentLink3URL: https://datasheet.ciiva.com/46435/1860449-46435420.pdf?src-supplier=Element14; ComponentLink3Description: https://datasheet.ciiva.com/46435/1860449-46435420.pdf?src-supplier=Element14; Supplier Part Number 1: 2946-2059-302/998-403CT-ND